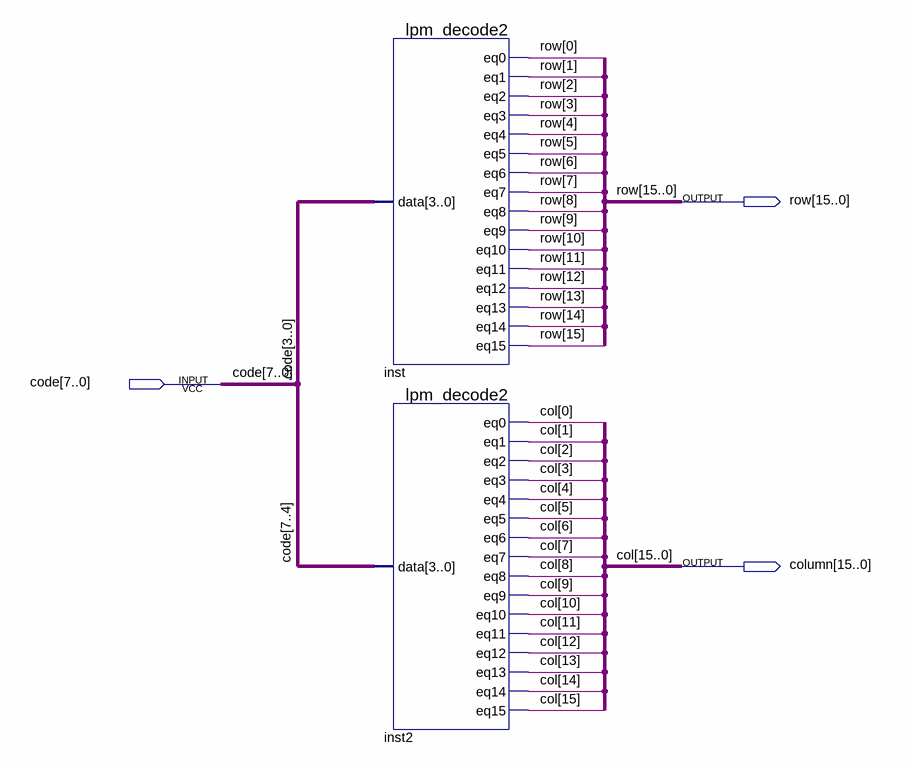
[diagram p0: schematic sheet]
// Quartus schematic row_col_decoder.bdf as structural Verilog: 2 symbols, 3 pins
module row_col_decoder (
  input  [7:0] code,
  output [15:0] row,
  output [15:0] column
);

  lpm_decode2 inst (
    .data(code[3:0]), .eq0(row[0]), .eq1(row[1]), .eq2(row[2]), .eq3(row[3]), .eq4(row[4]), .eq5(row[5]),
    .eq6(row[6]), .eq7(row[7]), .eq8(row[8]), .eq9(row[9]), .eq10(row[10]), .eq11(row[11]), .eq12(row[12]),
    .eq13(row[13]), .eq14(row[14]), .eq15(row[15]));
  lpm_decode2 inst2 (
    .data(code[7:4]), .eq0(column[0]), .eq1(column[1]), .eq2(column[2]), .eq3(column[3]), .eq4(column[4]),
    .eq5(column[5]), .eq6(column[6]), .eq7(column[7]), .eq8(column[8]), .eq9(column[9]), .eq10(column[10]),
    .eq11(column[11]), .eq12(column[12]), .eq13(column[13]), .eq14(column[14]), .eq15(column[15]));

  // Other names for the same wires on the sheet: col[15:0] = column
endmodule
